# EAGLE design SCH1001-001-008-320 - Program Flash Tester (EAGLE 9.4.2)
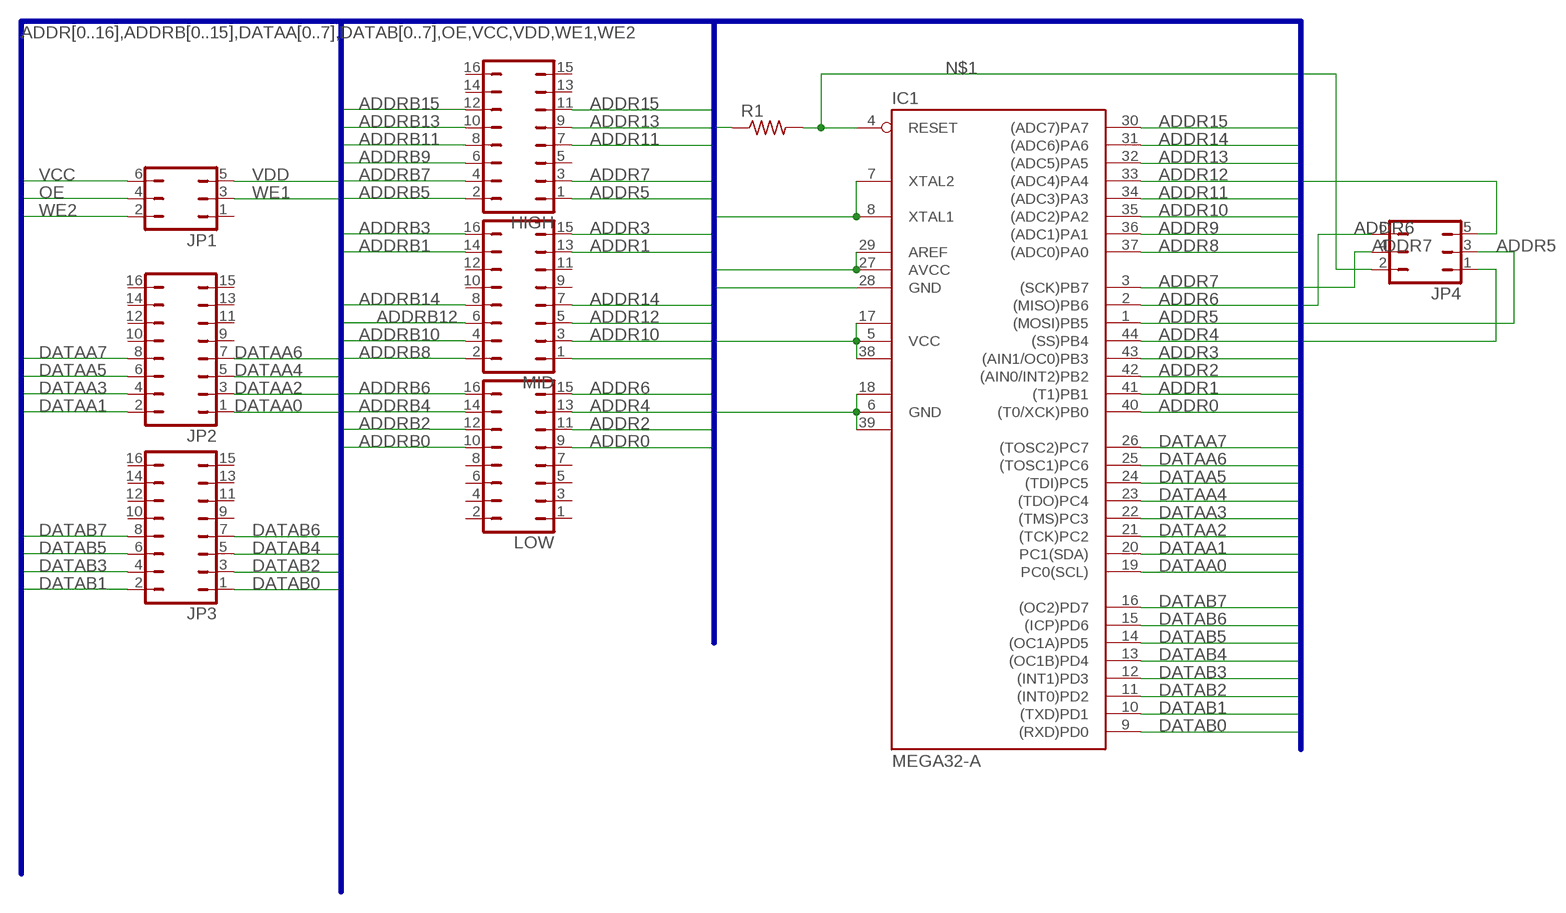
[diagram p0: schematic, sheet 1]

## Parts
HIGH  JP8Q  [JP8Q]
IC1  MEGA32-A  [TQFP44]
JP1  JP3Q  [JP3Q]
JP2  JP8Q  [JP8Q]
JP3  JP8Q  [JP8Q]
JP4  JP3Q  [JP3Q]
LOW  JP8Q  [JP8Q]
MID  JP8Q  [JP8Q]
R1  R-US_M1206  [M1206]

## Nets
ADDR0: IC1.40((T0/XCK)PB0) LOW.9
ADDR1: IC1.41((T1)PB1) MID.13
ADDR2: IC1.42((AIN0/INT2)PB2) LOW.11
ADDR3: IC1.43((AIN1/OC0)PB3) MID.15
ADDR4: IC1.44((SS)PB4) LOW.13
ADDR5: HIGH.1 IC1.1((MOSI)PB5) JP4.3
ADDR6: IC1.2((MISO)PB6) JP4.6 LOW.15
ADDR7: HIGH.3 IC1.3((SCK)PB7) JP4.4
ADDR8: IC1.37((ADC0)PA0) MID.1
ADDR9: IC1.36((ADC1)PA1)
ADDR10: IC1.35((ADC2)PA2) MID.3
ADDR11: HIGH.7 IC1.34((ADC3)PA3)
ADDR12: IC1.33((ADC4)PA4) MID.5
ADDR13: HIGH.9 IC1.32((ADC5)PA5)
ADDR14: IC1.31((ADC6)PA6) MID.7
ADDR15: HIGH.11 IC1.30((ADC7)PA7)
ADDRB0: LOW.10
ADDRB1: MID.14
ADDRB2: LOW.12
ADDRB3: MID.16
ADDRB4: LOW.14
ADDRB5: HIGH.2
ADDRB6: LOW.16
ADDRB7: HIGH.4
ADDRB8: MID.2
ADDRB9: HIGH.6
ADDRB10: MID.4
ADDRB11: HIGH.8
ADDRB12: MID.6
ADDRB13: HIGH.10
ADDRB14: MID.8
ADDRB15: HIGH.12
DATAA0: IC1.19(PC0(SCL)) JP2.1
DATAA1: IC1.20(PC1(SDA)) JP2.2
DATAA2: IC1.21((TCK)PC2) JP2.3
DATAA3: IC1.22((TMS)PC3) JP2.4
DATAA4: IC1.23((TDO)PC4) JP2.5
DATAA5: IC1.24((TDI)PC5) JP2.6
DATAA6: IC1.25((TOSC1)PC6) JP2.7
DATAA7: IC1.26((TOSC2)PC7) JP2.8
DATAB0: IC1.9((RXD)PD0) JP3.1
DATAB1: IC1.10((TXD)PD1) JP3.2
DATAB2: IC1.11((INT0)PD2) JP3.3
DATAB3: IC1.12((INT1)PD3) JP3.4
DATAB4: IC1.13((OC1B)PD4) JP3.5
DATAB5: IC1.14((OC1A)PD5) JP3.6
DATAB6: IC1.15((ICP)PD6) JP3.7
DATAB7: IC1.16((OC2)PD7) JP3.8
N$1: IC1.4(RESET) JP4.2 R1.2
OE: JP1.4
VCC [power]: IC1.5(VCC) IC1.17(VCC1) IC1.27(AVCC) IC1.29(AREF) IC1.38(VCC2) JP1.6 JP4.5 R1.1
VDD [power]: IC1.6(GND) IC1.7(XTAL2) IC1.8(XTAL1) IC1.18(GND1) IC1.28(GND) IC1.39(GND2) JP1.5 JP4.1
WE1: JP1.3
WE2: JP1.2
Unconnected: HIGH.5 HIGH.13 HIGH.14 HIGH.15 HIGH.16 JP1.1 JP2.9 JP2.10 JP2.11 JP2.12 JP2.13 JP2.14 JP2.15 JP2.16 JP3.9 JP3.10 JP3.11 JP3.12 JP3.13 JP3.14 JP3.15 JP3.16 LOW.1 LOW.2 LOW.3 LOW.4 LOW.5 LOW.6 LOW.7 LOW.8 MID.9 MID.10 MID.11 MID.12

## Buses
ADDR[0..16],ADDRB[0..15],DATAA[0..7],DATAB[0..7],OE,VCC,VDD,WE1,WE2

## Library data of the parts
HIGH JP2 JP3 LOW MID = jumper:JP8Q: JUMPER
IC1 = atmel:MEGA32: MICROCONTROLLER 32 Kbytes FLASH 2 Kbytes SRAM 1 Kbytes EEPROM USART 8-channel 10 bit ADC Source: www.atmel.com .. doc2503.pdf; MPN: ATMEGA32-16AU; OC_FARNELL: 9171274; OC_NEWARK: 69K6677
JP1 JP4 = jumper:JP3Q: JUMPER
R1 = rcl:R-US_: RESISTOR, American symbol; SPICEPREFIX: R

## Net classes
1 power: width 0.254 mm

## Board
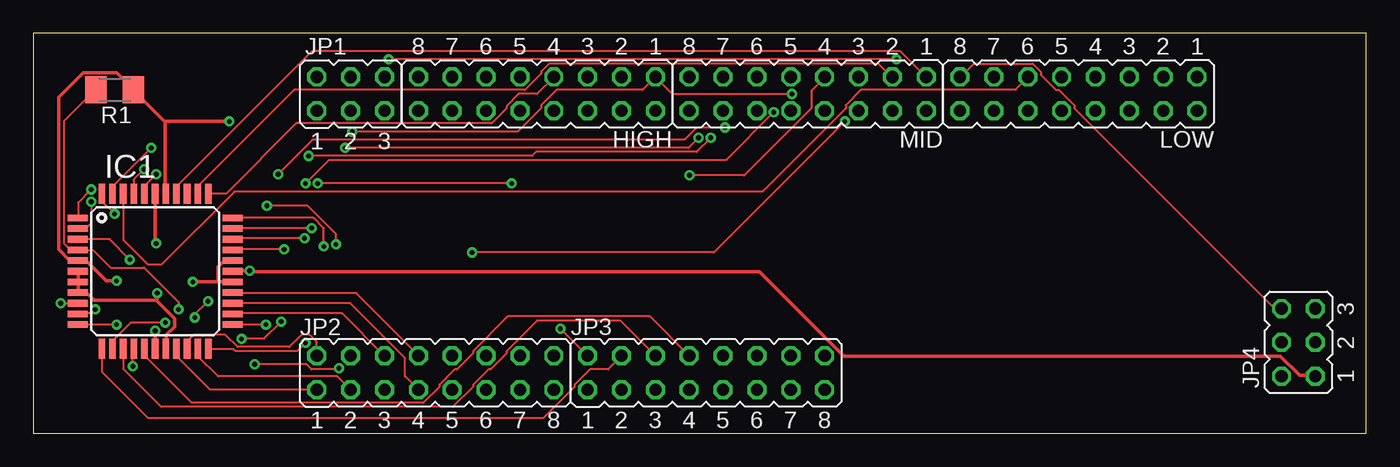
[diagram p1: board, top side]
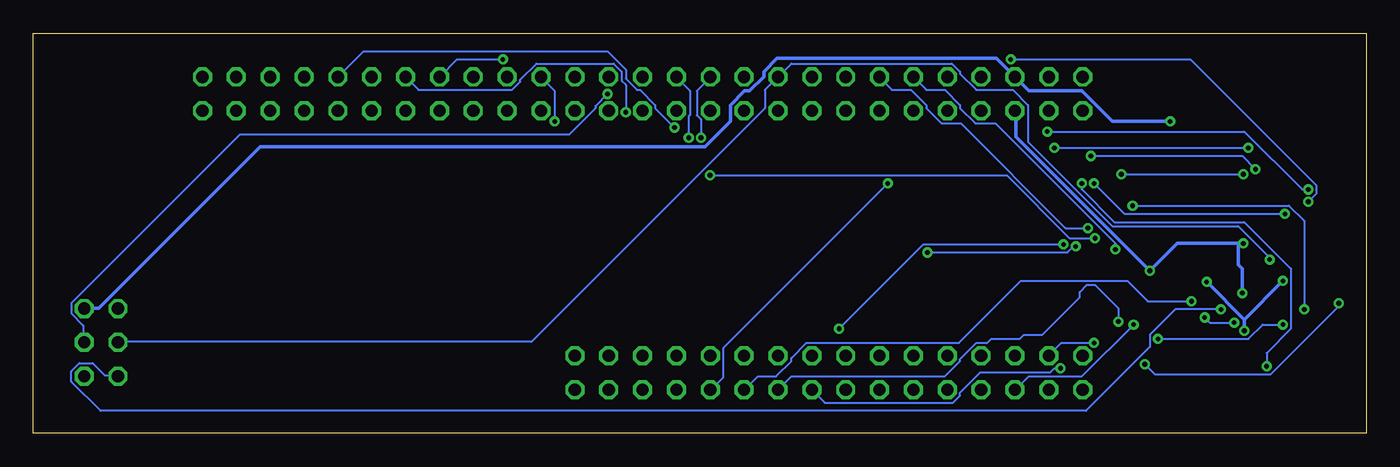
[diagram p2: board, bottom side, seen from below]

Size 100 x 30 mm. Coordinates in mm from the lower left corner, seen from the top.
Outline: 0,0 100,0 100,30 0,30 0,0
Copper layers (1*16): Top 0.035mm / dielectric 1.5mm / Bottom 0.035mm
Design rules "default": minimum track width 6mil, minimum drill 0.35mm, track to track 6mil, track to pad 6mil, pad to pad 6mil, via to via 6mil, smd to smd 6mil, copper to edge 40mil, drill to drill 6mil, minimum pad ring 10mil, minimum via ring 8mil, stop-mask expansion 4mil, vias tented up to drill 0mil, thermal gap 10mil

### Footprints (pad centres in the part's own frame; a part is rotated, then mirrored left to right if it is on the bottom)
JP8Q = drill 0.914 octagon: 1 -8.89,-1.27; 2 -8.89,1.27; 3 -6.35,-1.27; 4 -6.35,1.27; 5 -3.81,-1.27; 6 -3.81,1.27; 7 -1.27,-1.27; 8 -1.27,1.27; 9 1.27,-1.27; 10 1.27,1.27; 11 3.81,-1.27; 12 3.81,1.27; 13 6.35,-1.27; 14 6.35,1.27; 15 8.89,-1.27; 16 8.89,1.27
TQFP44 = smd 1.5 x 0.5: 1 -5.8,4; 2 -5.8,3.2; 3 -5.8,2.4; 4 -5.8,1.6; 5 -5.8,0.8; 6 -5.8,0; 7 -5.8,-0.8; 8 -5.8,-1.6; 9 -5.8,-2.4; 10 -5.8,-3.2; 11 -5.8,-4; 23 5.8,-4; 24 5.8,-3.2; 25 5.8,-2.4; 26 5.8,-1.6; 27 5.8,-0.8; 28 5.8,0; 29 5.8,0.8; 30 5.8,1.6; 31 5.8,2.4; 32 5.8,3.2; 33 5.8,4 | smd 0.5 x 1.5: 12 -4,-5.8; 13 -3.2,-5.8; 14 -2.4,-5.8; 15 -1.6,-5.8; 16 -0.8,-5.8; 17 0,-5.8; 18 0.8,-5.8; 19 1.6,-5.8; 20 2.4,-5.8; 21 3.2,-5.8; 22 4,-5.8; 34 4,5.8; 35 3.2,5.8; 36 2.4,5.8; 37 1.6,5.8; 38 0.8,5.8; 39 0,5.8; 40 -0.8,5.8; 41 -1.6,5.8; 42 -2.4,5.8; 43 -3.2,5.8; 44 -4,5.8
JP3Q = drill 0.914 octagon: 1 -2.54,-1.27; 2 -2.54,1.27; 3 0,-1.27; 4 0,1.27; 5 2.54,-1.27; 6 2.54,1.27
M1206 = smd 1.6 x 2: 1 -1.4,0; 2 1.4,0

### Placement (x,y rotation side)
HIGH  37.78,25.46 180 top
IC1  9.14,12.16 0 top
JP1  23.81,25.46 0 top
JP2  30.16,4.54 0 top
JP3  50.48,4.54 0 top
JP4  94.92,6.82 90 top
LOW  78.42,25.46 180 top
MID  58.1,25.46 180 top
R1  6.1,25.77 180 top

### Tracks (layer width: path | path; a pad name or v marks a point on that pad's centre or on a via)
ADDR0  (via drill 0.35)
  Top 0.152: v9.22,19.43 8.38,18.59 8.38,17.98 IC1.40 | v18.36,19.43 20.95,22.02 48.84,22.02 49.76,22.94 v51.89,22.94
  Bottom 0.152: v18.36,19.43 v9.22,19.43 | v51.89,22.94 53.34,24.38 53.34,24.61 54.48,25.76 54.71,25.76 55.55,26.59 55.55,27.28 56.92,28.65 75.21,28.65 77.11,26.75 LOW.9
ADDR1  (via drill 0.35)
  Top 0.152: v8.31,19.81 7.54,19.05 7.54,17.98 IC1.41 | v20.65,20.8 37.41,20.8 37.72,21.11 49.76,21.11 v50.83,22.17
  Bottom 0.152: v8.31,19.81 9.3,20.8 v20.65,20.8 | v50.83,22.17 50.83,23.77 50.75,23.85 50.75,25.68 51.74,26.67 MID.13
ADDR2
  Top 0.152: IC1.42 6.78,17.91 6.78,14.48 8.61,12.65 9.6,12.65 15.09,18.14 54.71,18.14 60.96,24.38 60.96,24.61 62.1,25.76 73.69,25.76 74.6,26.67 LOW.11
ADDR3  (via drill 0.35)
  Top 0.152: v8.84,21.41 5.94,18.52 5.94,17.98 IC1.43 | v23.39,21.41 49.15,21.41 v49.91,22.17
  Bottom 0.152: v23.39,21.41 v8.84,21.41 | v49.91,22.17 49.91,23.55 50.22,23.85 50.22,25.68 49.23,26.67 MID.15
ADDR4  (via drill 0.35)
  Top 0.152: v6.1,16.46 5.18,17.37 5.18,17.91 IC1.44 | v20.42,18.75 22.17,20.5 51.97,20.5 v55.55,24.08
  Bottom 0.152: v6.1,16.46 18.14,16.46 v20.42,18.75 | v55.55,24.08 55.55,26.14 55.85,26.44 55.85,27.13 56.46,27.74 62.26,27.74 63.48,26.52 63.48,26.36 64.08,25.76 71.09,25.76 72.01,26.67 LOW.13
ADDR5  (via drill 0.35)
  Top 0.152: v4.34,18.29 3.35,17.3 3.35,16.23 IC1.1 | v23.93,22.63 36.35,22.63 38.1,24.38 38.1,24.61 39.24,25.76 45.72,25.76 46.63,26.67 HIGH.1 46.71,26.67 47.93,25.45 v56.92,25.45
  Bottom 0.152: v4.34,18.29 4.8,18.29 9.14,22.63 v23.93,22.63 | v56.92,25.45 57.84,24.54 57.84,24.38 59.82,22.4 84.51,22.4 97.16,9.75 97.16,8.99 96.24,8.08 96.24,6.86 JP4.3
ADDR6  (via drill 0.35)
  Top 0.152: v4.34,17.37 4.34,15.77 3.96,15.39 3.35,15.39 IC1.2 | v64.77,28.04 v26.67,28.04 | JP4.6 93.65,9.37 93.12,9.37 78.11,24.38 78.11,24.61 76.96,25.76 76.73,25.76 75.59,26.9 75.59,27.13 74.98,27.74 70.56,27.74 69.57,26.75 LOW.15
  Bottom 0.152: v4.34,17.37 3.73,17.98 3.73,18.59 13.18,28.04 v26.67,28.04 | v64.77,28.04 68.2,28.04 69.49,26.75 LOW.15
ADDR7  (via drill 0.35)
  Top 0.152: v7.24,13.03 5.71,14.55 3.35,14.55 IC1.3
  Bottom 0.152: v7.24,13.03 7.24,13.18 9.6,15.54 19.05,15.54 25.38,21.87 25.38,24.61 26.52,25.76 29.26,25.76 30.48,26.98 30.48,27.13 31.09,27.74 43.13,27.74 44.12,26.75 HIGH.3 44.2,26.67 45.11,25.76 45.11,24.38 62.64,6.86 93.65,6.86 JP4.4
ADDR8
  Top 0.152: IC1.37 10.74,17.98 10.74,18.52 20.88,28.65 65.08,28.65 66.98,26.75 MID.1
ADDR10
  Top 0.152: IC1.35 12.34,17.98 12.34,18.52 19.58,25.76 36.88,25.76 38.1,26.98 38.1,27.13 38.71,27.74 63.4,27.74 64.39,26.75 MID.3
ADDR11
  Top 0.152: IC1.34 13.18,17.98 14.48,17.98 19.74,23.24 34.37,23.24 35.51,24.38 35.51,24.54 36.42,25.45 37.8,25.45 39.01,26.67 HIGH.7
ADDR12  (via drill 0.35)
  Top 0.152: v21.79,14.02 21.79,15.39 21.03,16.15 15.01,16.15 IC1.33 | v32.92,13.56 51.05,13.56 v60.88,23.39
  Bottom 0.152: v21.79,14.02 21.95,14.02 22.4,13.56 v32.92,13.56 | v60.88,23.39 60.88,25.68 61.87,26.67 MID.5
ADDR13  (via drill 0.35)
  Top 0.152: v20.88,15.39 15.01,15.39 IC1.32
  Bottom 0.152: v20.88,15.39 22.55,15.39 30.4,23.24 31.85,23.24 32.99,24.38 32.99,24.61 34.14,25.76 35.59,25.76 36.5,26.67 HIGH.9
ADDR14  (via drill 0.35)
  Top 0.152: v20.34,14.63 15.01,14.63 IC1.31 | v49.23,19.36 53.34,19.36 58.37,24.38 58.37,25.68 59.36,26.67 MID.7
  Bottom 0.152: v20.34,14.63 22.25,14.63 26.98,19.36 v49.23,19.36
ADDR15  (via drill 0.35)
  Top 0.152: v18.82,13.79 15.01,13.79 IC1.30
  Bottom 0.152: v18.82,13.79 18.82,14.25 27.81,23.24 29.34,23.24 30.48,24.38 30.48,24.61 31.62,25.76 32.99,25.76 33.91,26.67 HIGH.11
DATAA0
  Top 0.152: IC1.19 10.74,6.33 10.74,5.79 13.26,3.28 JP2.1
DATAA1
  Top 0.152: IC1.20 11.58,6.4 11.58,6.93 12.04,7.39 14.4,7.39 15.32,6.48 19.2,6.48 20.12,7.39 20.73,7.39 21.26,6.86 21.26,5.87 JP2.2
DATAA2
  Top 0.152: IC1.21 12.34,6.33 12.34,5.79 13.87,4.27 22.78,4.27 23.77,3.28 JP2.3
DATAA3  (via drill 0.35)
  Top 0.152: v20.42,6.78 19.81,6.17 15.16,6.17 15.01,6.33 13.18,6.33 IC1.22
  Bottom 0.152: v20.42,6.78 22.86,6.78 23.77,5.87 JP2.4
DATAA4  (via drill 0.35)
  Top 0.152: v17.45,8.15 15.01,8.15 IC1.23
  Bottom 0.152: v17.45,8.15 21.34,4.27 25.3,4.27 26.29,3.28 JP2.5
DATAA5
  Top 0.152: IC1.24 15.01,8.99 23.16,8.99 26.29,5.87 JP2.6
DATAA6
  Top 0.152: IC1.25 15.01,9.75 23.77,9.75 27.89,5.64 27.89,4.27 JP2.7
DATAA7
  Top 0.152: IC1.26 15.01,10.52 24.23,10.52 28.88,5.87 JP2.8
DATAB0  (via drill 0.35)
  Top 0.152: v2.06,9.75 3.28,9.75 IC1.9 | v16.61,5.18 20.5,5.18 20.88,4.8 22.86,4.8 v22.94,4.88
  Bottom 0.152: v2.06,9.75 2.06,9.53 7.16,4.42 15.85,4.42 v16.61,5.18 | v22.94,4.88 23.39,4.88 23.7,4.57 28.96,4.57 30.48,3.05 30.48,2.82 31.01,2.29 40.62,2.29 41.53,3.2 JP3.1
DATAB1  (via drill 0.35)
  Top 0.152: v4.65,9.3 4.34,8.99 3.35,8.99 IC1.10 | v17.53,17.07 20.57,17.07 22.71,14.94 v22.71,14.17 | v39.55,7.85 41.53,5.87 JP3.2
  Bottom 0.152: v4.65,9.3 4.65,15.93 5.79,17.07 v17.53,17.07 | v22.71,14.17 33.22,14.17 v39.55,7.85
DATAB2  (via drill 0.35)
  Top 0.152: v6.25,8.15 3.35,8.15 IC1.11 | v15.62,7.09 17.3,7.09 v18.59,8.38
  Bottom 0.152: v6.25,8.15 7.77,8.15 8.84,7.09 v15.62,7.09 | v18.59,8.38 18.59,9.37 20.34,11.12 20.95,11.12 21.49,10.59 21.49,10.21 24.31,7.39 25.68,7.39 25.98,7.09 28.12,7.09 28.42,6.78 29.26,6.78 30.48,5.56 30.48,5.41 31.62,4.27 43.13,4.27 JP3.3
DATAB3
  Top 0.152: IC1.12 5.18,6.33 5.18,4.57 8.61,1.14 38.25,1.14 40.62,3.5 40.62,3.66 41.76,4.8 43.13,4.8 44.12,5.79 JP3.4
DATAB4  (via drill 0.35)
  Top 0.152: v9.91,8.31 7.32,8.31 5.94,6.93 5.94,6.4 IC1.13 | v12.12,8.69 12.12,8.91 v13.11,9.91
  Bottom 0.152: v9.91,8.31 11.73,8.31 v12.12,8.69 | v13.11,9.91 16.38,9.91 17.91,11.43 25.91,11.43 30.56,6.78 41.99,6.78 43.13,5.64 43.13,5.41 44.27,4.27 45.64,4.27 46.63,3.28 JP3.5
DATAB5
  Top 0.152: IC1.14 6.78,6.33 6.78,4.8 9.6,1.98 31.47,1.98 32.99,3.5 32.99,3.66 34.14,4.8 34.29,4.8 35.51,6.02 35.51,6.17 37.8,8.46 44.04,8.46 46.63,5.87 JP3.6
DATAB6  (via drill 0.35)
  Top 0.152: v7.47,5.03 7.47,6.33 IC1.15 | v35.89,18.75 v21.34,18.75
  Bottom 0.152: v7.47,5.03 7.47,6.02 5.64,7.85 5.64,12.34 9.14,15.85 18.9,15.85 21.34,18.29 v21.34,18.75 | v35.89,18.75 48.23,6.4 48.23,4.19 49.15,3.28 JP3.7
DATAB7
  Top 0.152: IC1.16 8.38,6.33 8.38,5.79 11.89,2.29 29.26,2.29 30.48,3.5 30.48,3.66 31.62,4.8 31.77,4.8 32.99,6.02 32.99,6.17 35.59,8.76 46.25,8.76 49.15,5.87 JP3.8
N$1  (via drill 0.35)
  Top 0.152: R1.2 4.65,25.76 2.29,23.39 2.29,14.25 2.74,13.79 3.28,13.79 IC1.4 3.35,13.72 4.5,13.72 5.79,12.42 8.31,12.42 10.9,9.83 v10.9,9.3
  Bottom 0.152: v10.9,9.3 14.33,9.3 16.23,7.39 16.23,6.48 21.03,1.68 94.94,1.68 97.16,3.89 97.16,4.65 96.55,5.26 95.56,5.26 94.64,4.34 93.73,4.34 JP4.2
VCC  (via drill 0.35)
  Top 0.254: v9.14,7.7 9.14,6.4 IC1.17 | 13.87,11.35 IC1.27 | 13.87,11.35 v11.96,11.35 | 13.87,11.35 13.87,12.5 14.33,12.95 IC1.29 | 9.91,23.32 9.91,17.98 IC1.38 | 9.91,23.32 7.54,25.68 R1.1 7.47,25.83 6.25,27.05 3.73,27.05 1.91,25.22 1.91,13.79 2.67,13.03 3.28,13.03 IC1.5 3.43,12.88 4.04,12.88 5.49,11.43 v6.25,11.43 | v14.71,23.39 9.98,23.39 9.91,23.32
  Bottom 0.254: 9.14,8.53 v9.14,7.7 | v11.96,11.35 9.14,8.53 | v6.25,11.43 9.14,8.53 | JP4.5 96.16,9.37 95.1,9.37 82.98,21.49 49.61,21.49 47.7,23.39 47.7,24.61 46.63,25.68 46.25,25.68 45.19,26.75 45.19,27.13 44.2,28.12 27.74,28.12 26.36,26.75 JP1.6 26.29,26.67 25.3,25.68 21.34,25.68 19.05,23.39 v14.71,23.39
VDD  (via drill 0.35)
  Top 0.254: IC1.6 3.35,12.12 3.35,11.43 IC1.7 3.35,11.35 3.35,10.59 IC1.8 3.43,10.52 4.04,10.52 4.57,9.98 9.22,9.98 | 9.22,9.98 10.59,8.61 10.59,8 9.98,7.39 9.98,6.4 IC1.18 | IC1.28 15.01,12.19 v16.23,12.19 16.31,12.12 54.48,12.12 60.81,5.79 93.57,5.79 95.02,4.34 96.16,4.34 JP4.1 | v9.22,14.25 9.14,14.33 9.14,17.91 IC1.39 | v9.3,10.52 9.3,10.06 9.22,9.98
  Bottom 0.254: JP1.5 26.29,24.16 26.29,22.25 v16.23,12.19 14.17,14.25 9.6,14.25 | 9.6,14.25 v9.22,14.25 | v9.3,10.52 9.3,12.34 9.6,12.65 9.6,14.25